# EAGLE design nanobone (EAGLE 6.3)
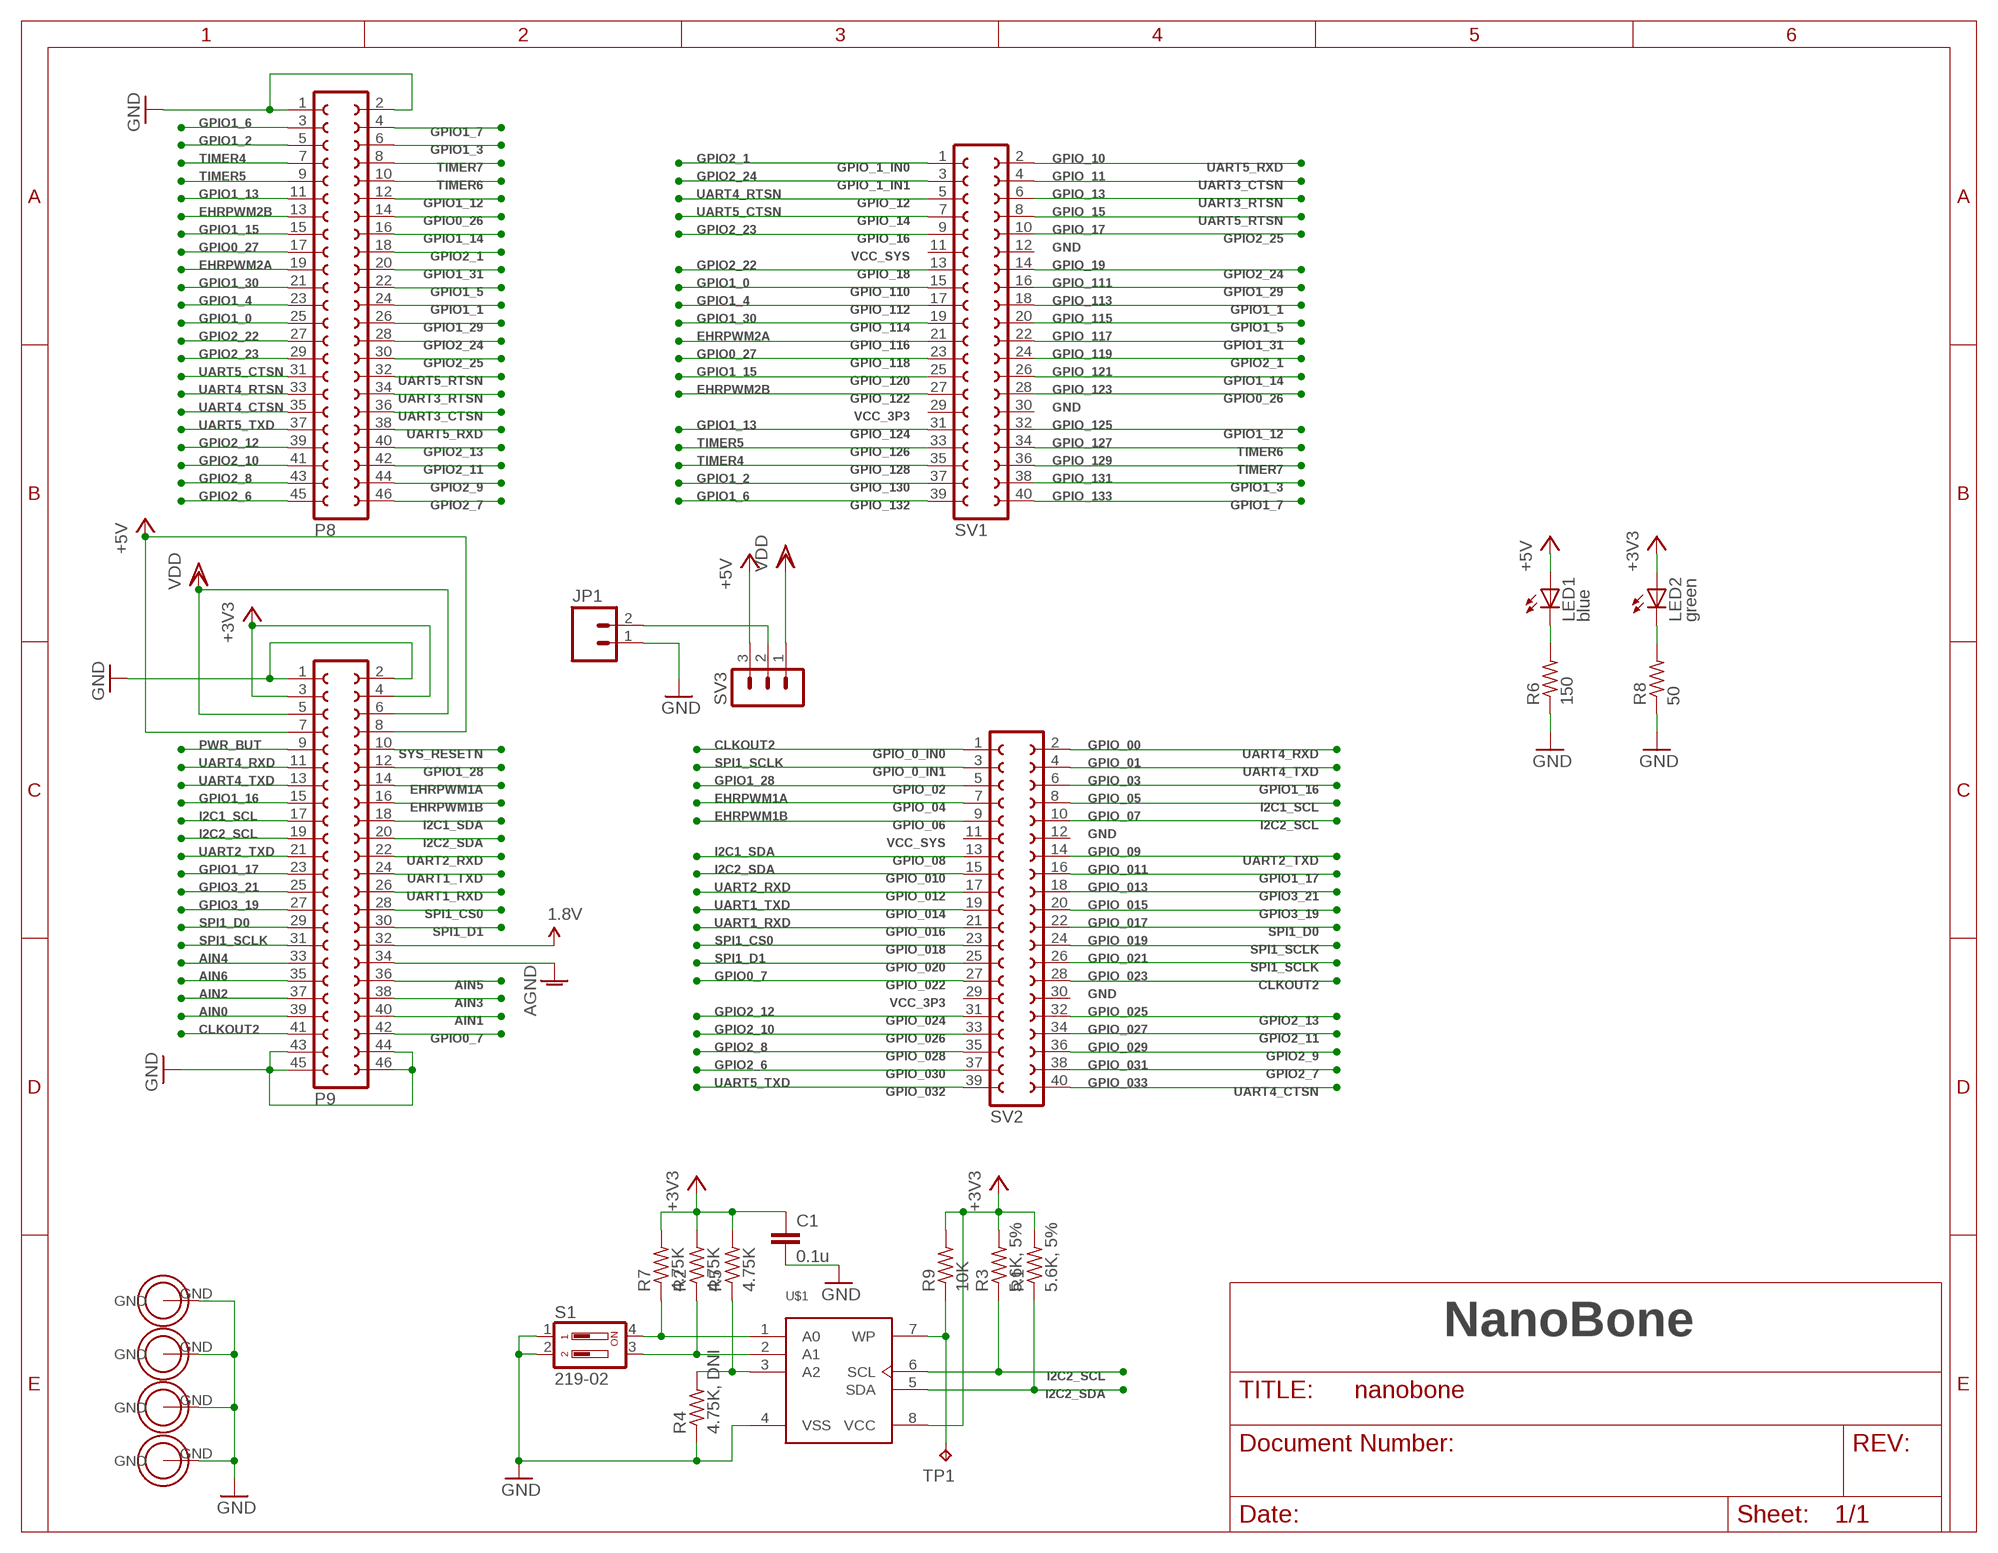
[diagram p0: schematic, sheet 1]

## Parts
C1  0.1u  C-EUC0603  [C0603]
H1  HOLE  [HOLE]
H2  HOLE  [HOLE]
H3  HOLE  [HOLE]
H4  HOLE  [HOLE]
JP1  M02LOCK_LONGPADS  [1X02_LOCK_LONGPADS]
LED1  blue  LEDCHIPLED_0603  [CHIPLED_0603]
LED2  green  LEDCHIPLED_0603  [CHIPLED_0603]
P8  FE23-2_SMD  [FE23-2_SMD]
P9  FE23-2_SMD  [FE23-2_SMD]
R1  5.6K, 5%  R-US_R0603  [R0603]
R2  4.75K  R-US_R0603  [R0603]
R3  5.6K, 5%  R-US_R0603  [R0603]
R4  4.75K, DNI  R-US_R0603  [R0603]
R5  4.75K  R-US_R0603  [R0603]
R6  150  R-US_R0603  [R0603]
R7  4.75K  R-US_R0603  [R0603]
R8  50  R-US_R0603  [R0603]
R9  10K  R-US_R0603  [R0603]
S1  219-02  [CTS-219-02]
SV1  FE20-2  [FE20-2]
SV2  FE20-2  [FE20-2]
SV3  MA03-1  [MA03-1]
TP1  TPB2,54  [B2,54]
U$1  CAT24C256  [SOIC8]

## Nets
1.8V: P9.32
+3V3 [pwr]: C1.1 LED2.A P9.3 P9.4 R1.2 R2.2 R3.2 R5.2 R7.2 R9.2 U$1.8(VCC)
+5V [pwr]: LED1.A P9.7 P9.8 SV3.3
AGND: P9.34
AIN0: P9.39
AIN1: P9.40
AIN2: P9.37
AIN3: P9.38
AIN4: P9.33
AIN5: P9.36
AIN6: P9.35
CLKOUT2: P9.41 SV2.1 SV2.28
EHRPWM1A: P9.14 SV2.7
EHRPWM1B: P9.16 SV2.9
EHRPWM2A: P8.19 SV1.21
EHRPWM2B: P8.13 SV1.27
GND [pwr]: C1.2 H1.GND H2.GND H3.GND H4.GND JP1.1 P8.1 P8.2 P9.1 P9.2 P9.43 P9.44 P9.45 P9.46 R4.1 R6.1 R8.1 S1.1 S1.2 U$1.4(VSS)
GPIO0_7: P9.42 SV2.27
GPIO0_26: P8.14 SV1.28
GPIO0_27: P8.17 SV1.23
GPIO1_0: P8.25 SV1.15
GPIO1_1: P8.24 SV1.18
GPIO1_2: P8.5 SV1.37
GPIO1_3: P8.6 SV1.38
GPIO1_4: P8.23 SV1.17
GPIO1_5: P8.22 SV1.20
GPIO1_6: P8.3 SV1.39
GPIO1_7: P8.4 SV1.40
GPIO1_12: P8.12 SV1.32
GPIO1_13: P8.11 SV1.31
GPIO1_14: P8.16 SV1.26
GPIO1_15: P8.15 SV1.25
GPIO1_16: P9.15 SV2.6
GPIO1_17: P9.23 SV2.16
GPIO1_28: P9.12 SV2.5
GPIO1_29: P8.26 SV1.16
GPIO1_30: P8.21 SV1.19
GPIO1_31: P8.20 SV1.22
GPIO2_1: P8.18 SV1.1 SV1.24
GPIO2_6: P8.45 SV2.37
GPIO2_7: P8.46 SV2.38
GPIO2_8: P8.43 SV2.35
GPIO2_9: P8.44 SV2.36
GPIO2_10: P8.41 SV2.33
GPIO2_11: P8.42 SV2.34
GPIO2_12: P8.39 SV2.31
GPIO2_13: P8.40 SV2.32
GPIO2_22: P8.27 SV1.13
GPIO2_23: P8.29 SV1.9
GPIO2_24: P8.28 SV1.3 SV1.14
GPIO2_25: P8.30 SV1.10
GPIO3_19: P9.27 SV2.20
GPIO3_21: P9.25 SV2.18
I2C1_SCL: P9.17 SV2.8
I2C1_SDA: P9.18 SV2.13
I2C2_SCL: P9.19 R3.1 SV2.10 U$1.6(SCL)
I2C2_SDA: P9.20 R1.1 SV2.15 U$1.5(SDA)
N$1: R7.1 S1.4 U$1.1(A0)
N$2: R2.1 S1.3 U$1.2(A1)
N$3: R4.2 R5.1 U$1.3(A2)
N$4: JP1.2 SV3.2
N$5: R9.1 TP1.TP U$1.7(WP)
N$6: LED1.C R6.2
N$7: LED2.C R8.2
PWR_BUT: P9.9
SPI1_CS0: P9.28 SV2.23
SPI1_D0: P9.29 SV2.22
SPI1_D1: P9.30 SV2.25
SPI1_SCLK: P9.31 SV2.3 SV2.24 SV2.26
SYS_RESETN: P9.10
TIMER4: P8.7 SV1.35
TIMER5: P8.9 SV1.33
TIMER6: P8.10 SV1.34
TIMER7: P8.8 SV1.36
UART1_RXD: P9.26 SV2.21
UART1_TXD: P9.24 SV2.19
UART2_RXD: P9.22 SV2.17
UART2_TXD: P9.21 SV2.14
UART3_CTSN: P8.36 SV1.4
UART3_RTSN: P8.34 SV1.6
UART4_CTSN: P8.35 SV2.40
UART4_RTSN: P8.33 SV1.5
UART4_RXD: P9.11 SV2.2
UART4_TXD: P9.13 SV2.4
UART5_CTSN: P8.31 SV1.7
UART5_RTSN: P8.32 SV1.8
UART5_RXD: P8.38 SV1.2
UART5_TXD: P8.37 SV2.39
VDD [pwr]: P9.5 P9.6 SV3.1
Unconnected: SV1.11 SV1.12 SV1.29 SV1.30 SV2.11 SV2.12 SV2.29 SV2.30

## Notes on the sheet
- GPIO_1_IN0 | GPIO_10
- GPIO_1_IN1 | GPIO_11
- GPIO_12 | GPIO_13
- GPIO_14 | GPIO_15
- GPIO_16 | GPIO_17
- VCC_SYS | GND
- GPIO_18 | GPIO_19
- GPIO_110 | GPIO_111
- GPIO_112 | GPIO_113
- GPIO_114 | GPIO_115
- GPIO_116 | GPIO_117
- GPIO_118 | GPIO_119
- GPIO_120 | GPIO_121
- GPIO_122 | GPIO_123
- VCC_3P3 | GND
- GPIO_124 | GPIO_125
- GPIO_126 | GPIO_127
- GPIO_128 | GPIO_129
- GPIO_130 | GPIO_131
- GPIO_132 | GPIO_133
- GPIO_0_IN0 | GPIO_00
- GPIO_0_IN1 | GPIO_01
- GPIO_02 | GPIO_03
- GPIO_04 | GPIO_05
- GPIO_06 | GPIO_07
- VCC_SYS | GND
- GPIO_08 | GPIO_09
- GPIO_010 | GPIO_011
- GPIO_012 | GPIO_013
- GPIO_014 | GPIO_015
- GPIO_016 | GPIO_017
- GPIO_018 | GPIO_019
- GPIO_020 | GPIO_021
- GPIO_022 | GPIO_023
- VCC_3P3 | GND
- GPIO_024 | GPIO_025
- GPIO_026 | GPIO_027
- GPIO_028 | GPIO_029
- GPIO_030 | GPIO_031
- GPIO_032 | GPIO_033
- NanoBone

## Library data of the parts
C1 = rcl:C-EU: CAPACITOR, European symbol; MPN: VJ0603V104ZXXCW1BC
H1-H4 = BoneCapeParts:HOLE
JP1 = SparkFun-Connectors:M02: Header 2 Standard 2-pin 0.1" header. Use with straight break away headers (SKU : PRT-00116), right angle break away headers (PRT-00553), swiss pins (PRT-00743), machine pins (PRT-00117), and female headers (PRT-00115). Molex polarized connector foot print use with SKU : PRT-08233 with associated crimp pins and housings.
LED1 = led:LED: LED OSRAM: - CHIPLED LG R971, LG N971, LY N971, LG Q971, LY Q971, LO R971, LY R971 LH N974, LH R974 LS Q976, LO Q976, LY Q976 LO Q996 - Hyper CHIPLED LW Q18S LB Q993, LB Q99A, LB R99A - SideLED LS A670, LO A670, LY A670, LG A670, LP A670 LB A673, LV A673, LT A673, LW A673 LH A674 LY A675 LS A676, LA A676, LO A676, LY A676, LW A676 LS A679, LY A679, LG A679 - Hyper Micro SIDELED® LS Y876, LA Y876, LO Y876, LY Y876 LT Y87S - SmartLED LW L88C, LW L88S LB L89C, LB L89S, LG L890 LS L89K, LO L89K, LY L89K LS L896, LA L896, LO L896, LY L896 - TOPLED LS T670, LO T670, LY T670, LG T670, LP T670 LSG T670, LSP T670, LSY T670, LOP T670, LYG T670 LG T671, LOG T671, LSG T671 LB T673, LV T673, LT T673, LW T673 LH T674 LS T676, LA T676, LO T676, LY T676, LB T676, LH T676, LSB T676, LW T676 LB T67C, LV T67C, LT T67C, LS T67K, LO T67K, LY T67K, LW E67C LS E67B, LA E67B, LO E67B, LY E67B, LB E67C, LV E67C, LT E67C LW T67C LS T679, LY T679, LG T679 LS T770, LO T770, LY T770, LG T770, LP T770 LB T773, LV T773, LT T773, LW T773 LH T774 LS E675, LA E675, LY E675, LS T675 LS T776, LA T776, LO T776, LY T776, LB T776 LHGB T686 LT T68C, LB T68C - Hyper Mini TOPLED® LB M676 - Mini TOPLED Santana® LG M470 LS M47K, LO M47K, LY M47K Source: http://www.osram.convergy.de LUXEON: - LUMILED® LXK2-PW12-R00, LXK2-PW12-S00, LXK2-PW14-U00, LXK2-PW14-V00 LXK2-PM12-R00, LXK2-PM12-S00, LXK2-PM14-U00 LXK2-PE12-Q00, LXK2-PE12-R00, LXK2-PE12-S00, LXK2-PE14-T00, LXK2-PE14-U00 LXK2-PB12-K00, LXK2-PB12-L00, LXK2-PB12-M00, LXK2-PB14-N00, LXK2-PB14-P00, LXK2-PB14-Q00 LXK2-PR12-L00, LXK2-PR12-M00, LXK2-PR14-Q00, LXK2-PR14-R00 LXK2-PD12-Q00, LXK2-PD12-R00, LXK2-PD12-S00 LXK2-PH12-R00, LXK2-PH12-S00 LXK2-PL12-P00, LXK2-PL12-Q00, LXK2-PL12-R00 Source: www.luxeon.com KINGBRIGHT: KA-3528ASYC Source: www.kingbright.com; MPN: HT-193NB-5589
LED2 = led:LED: LED OSRAM: - CHIPLED LG R971, LG N971, LY N971, LG Q971, LY Q971, LO R971, LY R971 LH N974, LH R974 LS Q976, LO Q976, LY Q976 LO Q996 - Hyper CHIPLED LW Q18S LB Q993, LB Q99A, LB R99A - SideLED LS A670, LO A670, LY A670, LG A670, LP A670 LB A673, LV A673, LT A673, LW A673 LH A674 LY A675 LS A676, LA A676, LO A676, LY A676, LW A676 LS A679, LY A679, LG A679 - Hyper Micro SIDELED® LS Y876, LA Y876, LO Y876, LY Y876 LT Y87S - SmartLED LW L88C, LW L88S LB L89C, LB L89S, LG L890 LS L89K, LO L89K, LY L89K LS L896, LA L896, LO L896, LY L896 - TOPLED LS T670, LO T670, LY T670, LG T670, LP T670 LSG T670, LSP T670, LSY T670, LOP T670, LYG T670 LG T671, LOG T671, LSG T671 LB T673, LV T673, LT T673, LW T673 LH T674 LS T676, LA T676, LO T676, LY T676, LB T676, LH T676, LSB T676, LW T676 LB T67C, LV T67C, LT T67C, LS T67K, LO T67K, LY T67K, LW E67C LS E67B, LA E67B, LO E67B, LY E67B, LB E67C, LV E67C, LT E67C LW T67C LS T679, LY T679, LG T679 LS T770, LO T770, LY T770, LG T770, LP T770 LB T773, LV T773, LT T773, LW T773 LH T774 LS E675, LA E675, LY E675, LS T675 LS T776, LA T776, LO T776, LY T776, LB T776 LHGB T686 LT T68C, LB T68C - Hyper Mini TOPLED® LB M676 - Mini TOPLED Santana® LG M470 LS M47K, LO M47K, LY M47K Source: http://www.osram.convergy.de LUXEON: - LUMILED® LXK2-PW12-R00, LXK2-PW12-S00, LXK2-PW14-U00, LXK2-PW14-V00 LXK2-PM12-R00, LXK2-PM12-S00, LXK2-PM14-U00 LXK2-PE12-Q00, LXK2-PE12-R00, LXK2-PE12-S00, LXK2-PE14-T00, LXK2-PE14-U00 LXK2-PB12-K00, LXK2-PB12-L00, LXK2-PB12-M00, LXK2-PB14-N00, LXK2-PB14-P00, LXK2-PB14-Q00 LXK2-PR12-L00, LXK2-PR12-M00, LXK2-PR14-Q00, LXK2-PR14-R00 LXK2-PD12-Q00, LXK2-PD12-R00, LXK2-PD12-S00 LXK2-PH12-R00, LXK2-PH12-S00 LXK2-PL12-P00, LXK2-PL12-Q00, LXK2-PL12-R00 Source: www.luxeon.com KINGBRIGHT: KA-3528ASYC Source: www.kingbright.com; MPN: LG Q971-KN-1
P8 P9 = BoneCapeParts:FE23-2_SMD: FEMALE HEADER; MPN: NPPC232KFMS-RC; OC_FARNELL: unknown; OC_NEWARK: unknown
R1 R3 = rcl:R-US_: RESISTOR, American symbol; MPN: RK73B1JTTDD562J
R2 R4 R5 R7 = rcl:R-US_: RESISTOR, American symbol; MPN: CR0603-FX-4751GLF
R6 = rcl:R-US_: RESISTOR, American symbol; MPN: 302-150-RC
R8 = rcl:R-US_: RESISTOR, American symbol; MPN: 302-49.9-RC
R9 = rcl:R-US_: RESISTOR, American symbol; MPN: WR06X1002FTL
S1 = switch-dil:219-02*: Surface Mount DIP Switch Series 219 SMT CTS Electronic Components Sourc: www.ctscorp.com; MPN: 219-2MST; OC_FARNELL: unknown; OC_NEWARK: unknown
SV1 SV2 = BoneCapeParts:FE20-2: FEMALE HEADER; MPN: NPPC202KFMS-RC; OC_FARNELL: unknown; OC_NEWARK: unknown
SV3 = con-lstb:MA03-1: PIN HEADER; OC_FARNELL: unknown; OC_NEWARK: unknown
TP1 = testpad:TP: Test pad
U$1 = BoneCapeParts:CAT24C256; MPN: CAT24C256WI-GT3

## Net classes
0 default: width 0.203 mm, drill 0.381 mm, clearance 0.203 mm
1 pwr: width 0.61 mm, drill 0.508 mm, clearance 0.203 mm

## Board
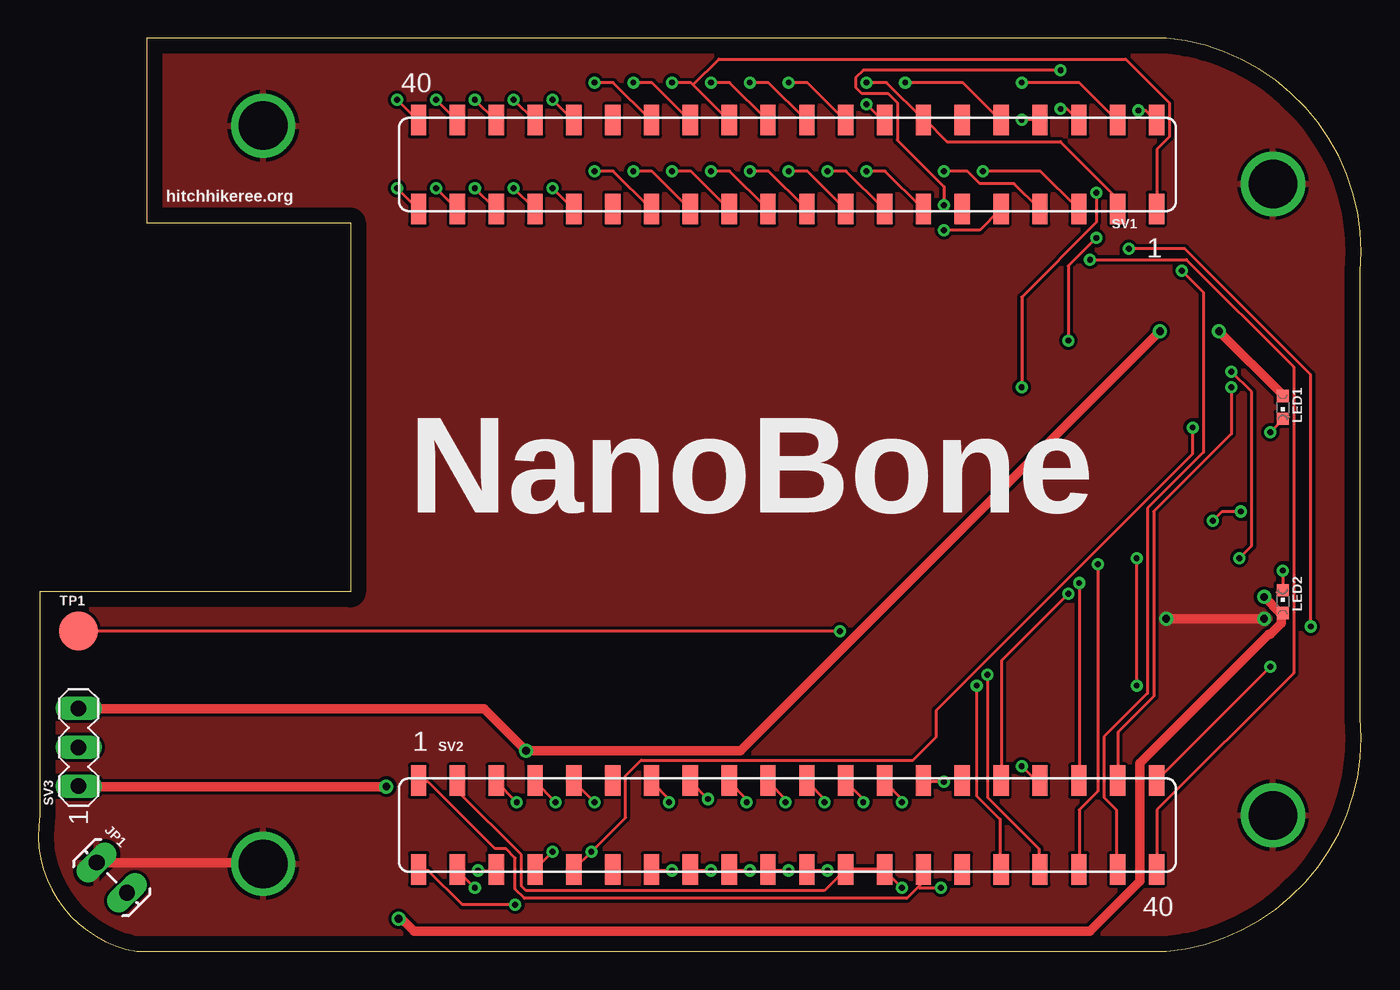
[diagram p1: board, top side]
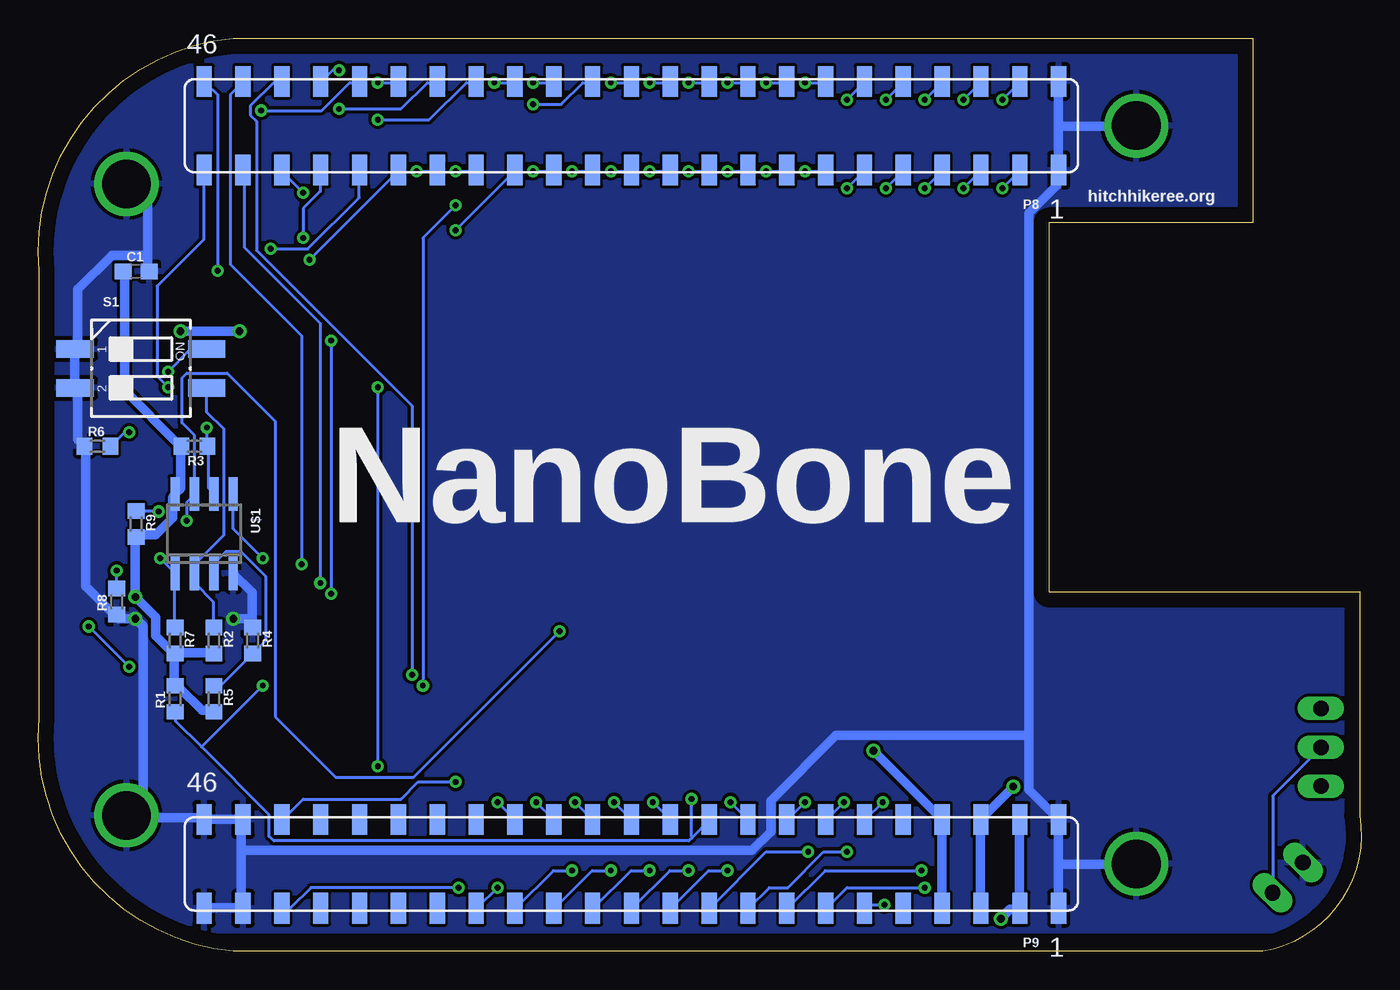
[diagram p2: board, bottom side, seen from below]

Size 86.52 x 59.69 mm. Coordinates in mm from the lower left corner, seen from the top.
Outline: 0.1,23.49 0.1,8.89 arc90 6.45,0 73.76,0 arc90 86.46,15.24 86.46,44.45 arc90 73.76,59.69 7.09,59.69 7.09,47.62 20.42,47.62 20.42,23.49 0.1,23.49
Copper layers (1*16): Top 0.035mm / dielectric 1.5mm / Bottom 0.035mm
Design rules "default *": minimum track width 6mil, minimum drill 15mil, track to track 8mil, track to pad 8mil, pad to pad 8mil, via to via 8mil, smd to smd 8mil, copper to edge 40mil, drill to drill 8mil, minimum pad ring 10mil, minimum via ring 8mil, stop-mask expansion 4mil, vias tented up to drill 20mil, thermal gap 10mil

### Footprints (pad centres in the part's own frame; a part is rotated, then mirrored left to right if it is on the bottom)
C0603 = smd 1.1 x 1: 1 -0.85,0; 2 0.85,0
HOLE = drill 3.175: GND 0,0
1X02_LOCK_LONGPADS = drill 1.016 long: 1 -0.127,0; 2 2.667,0
CHIPLED_0603 = smd 0.8 x 0.8: A 0,-0.75; C 0,0.75
FE23-2_SMD = smd 1 x 2: 1 -24.13,2.9; 2 -24.13,-2.9; 3 -21.59,2.9; 4 -21.59,-2.9; 5 -19.05,2.9; 6 -19.05,-2.9; 7 -16.51,2.9; 8 -16.51,-2.9; 9 -13.97,2.9; 10 -13.97,-2.9; 11 -11.43,2.9; 12 -11.43,-2.9; 13 -8.89,2.9; 14 -8.89,-2.9; 15 -6.35,2.9; 16 -6.35,-2.9; 17 -3.81,2.9; 18 -3.81,-2.9; 19 -1.27,2.9; 20 -1.27,-2.9; 21 1.27,2.9; 22 1.27,-2.9; 23 3.81,2.9; 24 3.81,-2.9; 25 6.35,2.9; 26 6.35,-2.9; 27 8.89,2.9; 28 8.89,-2.9; 29 11.43,2.9; 30 11.43,-2.9; 31 13.97,2.9; 32 13.97,-2.9; 33 16.51,2.9; 34 16.51,-2.9; 35 19.05,2.9; 36 19.05,-2.9; 37 21.59,2.9; 38 21.59,-2.9; 39 24.13,2.9; 40 24.13,-2.9; 41 26.67,2.9; 42 26.67,-2.9; 43 29.21,2.9; 44 29.21,-2.9; 45 31.75,2.9; 46 31.75,-2.9
R0603 = smd 1 x 1.1: 1 -0.85,0; 2 0.85,0
CTS-219-02 = smd 1.13 x 2.44: 1 -1.27,-4.3; 2 1.27,-4.3; 3 1.27,4.3; 4 -1.27,4.3
FE20-2 = smd 1 x 2: 1 -24.13,2.9; 2 -24.13,-2.9; 3 -21.59,2.9; 4 -21.59,-2.9; 5 -19.05,2.9; 6 -19.05,-2.9; 7 -16.51,2.9; 8 -16.51,-2.9; 9 -13.97,2.9; 10 -13.97,-2.9; 11 -11.43,2.9; 12 -11.43,-2.9; 13 -8.89,2.9; 14 -8.89,-2.9; 15 -6.35,2.9; 16 -6.35,-2.9; 17 -3.81,2.9; 18 -3.81,-2.9; 19 -1.27,2.9; 20 -1.27,-2.9; 21 1.27,2.9; 22 1.27,-2.9; 23 3.81,2.9; 24 3.81,-2.9; 25 6.35,2.9; 26 6.35,-2.9; 27 8.89,2.9; 28 8.89,-2.9; 29 11.43,2.9; 30 11.43,-2.9; 31 13.97,2.9; 32 13.97,-2.9; 33 16.51,2.9; 34 16.51,-2.9; 35 19.05,2.9; 36 19.05,-2.9; 37 21.59,2.9; 38 21.59,-2.9; 39 24.13,2.9; 40 24.13,-2.9
MA03-1 = drill 1.016 long: 1 -2.54,0; 2 0,0; 3 2.54,0
B2,54 = smd 2.54 x 2.54: TP 0,0
SOIC8 = smd 0.6 x 2.2: 1 -1.905,-2.6; 2 -0.635,-2.6; 3 0.635,-2.6; 4 1.905,-2.6; 5 1.905,2.6; 6 0.635,2.6; 7 -0.635,2.6; 8 -1.905,2.6

### Placement (x,y rotation side)
C1  80.11,44.45 0 bottom
H1  14.71,5.72 0 top
H2  80.75,8.89 0 top
H3  14.71,53.97 0 top
H4  80.75,50.16 0 top
JP1  3.91,5.72 315 top
LED1  [CHIPLED_0603]  81.38,35.56 180 top
LED2  [CHIPLED_0603]  81.38,22.86 0 top
P8  43.92,53.97 180 bottom
P9  43.92,5.72 180 bottom
R1  77.57,16.51 90 bottom
R2  75.03,20.32 270 bottom
R3  76.3,33.02 180 bottom
R4  72.49,20.32 270 bottom
R5  75.03,16.51 270 bottom
R6  4.75K  [R0603]  82.65,33.02 0 bottom
R7  77.57,20.32 270 bottom
R8  4.75K  [R0603]  81.38,22.86 90 bottom
R9  80.11,27.94 270 bottom
S1  79.81,38.1 270 bottom
SV1  49,51.43 180 top
SV2  49,8.25 0 top
SV3  2.64,13.33 90 top
TP1  2.64,20.96 0 top
U$1  75.67,27.3 0 bottom

### Tracks (layer width: path | path; a pad name or v marks a point on that pad's centre or on a via)
+3V3  (via drill 0.51)
  Top 0.61: v80.16,23.16 81.18,22.15 81.38,22.15 LED2.A 81.28,21.84 81.28,21.44 80.57,20.73 80.47,20.73 72.04,12.29 72.04,4.57 68.79,1.32 24.59,1.32 23.78,2.13 v23.57,2.13
  Bottom 0.61: P9.4 22.35,8.53 22.35,2.84 P9.3 22.66,2.74 22.96,2.74 v23.57,2.13 | R2.2 75.08,19.51 77.52,19.51 R7.2 | R5.2 75.08,15.75 75.8,15.75 77.32,17.27 77.52,17.27 R1.2 77.62,17.68 77.62,19.2 R7.2 | C1.1 80.88,44.4 80.88,36.68 77.42,33.22 R3.2 77.22,33.02 77.22,30.28 77.52,29.97 U$1.8 77.73,29.67 77.73,28.35 78.84,27.23 79.86,27.23 R9.2 80.16,27.03 v80.16,23.16 78.84,21.84 78.84,20.62 77.83,19.61 R7.2
+5V  (via drill 0.51)
  Top 0.61: v77.22,40.54 81.38,36.37 LED1.A | v73.36,40.54 45.93,13.11 v31.9,13.11 29.16,15.85 2.64,15.85 SV3.3
  Bottom 0.61: v73.36,40.54 v77.22,40.54 | v31.9,13.11 27.43,8.64 P9.8 27.43,8.33 27.43,2.84 P9.7
CLKOUT2  (via drill 0.38)
  Top 0.203: 57.56,4.22 57.81,4.47 57.81,5.28 SV2.28 | 57.56,4.22 56.8,3.45 31.8,3.45 31.19,4.06 31.19,6.1 30.58,6.71 29.87,6.71 25.5,11.07 24.89,11.07 SV2.1 | v59.03,4.17 57.61,4.17 57.56,4.22
  Bottom 0.203: v59.03,4.17 68.68,4.17 70,2.84 70.51,2.84 P9.41
EHRPWM1A  (via drill 0.38)
  Top 0.203: v33.83,9.75 32.51,11.07 SV2.7
  Bottom 0.203: v33.83,9.75 34.95,8.64 P9.14
EHRPWM1B  (via drill 0.38)
  Top 0.203: v36.37,9.75 35.05,11.07 SV2.9
  Bottom 0.203: v36.37,9.75 37.49,8.64 P9.16
EHRPWM2A  (via drill 0.38)
  Top 0.203: v43.99,51 45.21,51 47.65,48.56 SV1.21
  Bottom 0.203: v43.99,51 42.67,51 P8.19
EHRPWM2B  (via drill 0.38)
  Top 0.203: v36.37,51 37.59,51 40.03,48.56 SV1.27
  Bottom 0.203: v36.37,51 35.05,51 P8.13
GND  (via drill 0.51)
  Top 0.61: v80.16,21.74 v73.76,21.74 | JP1.1 3.86,5.79 14.63,5.79 H1.GND
  Bottom 0.61: P9.45 75.59,2.84 73.15,2.84 P9.43 73.26,3.15 73.26,6.6 | 73.26,6.6 73.26,8.33 P9.44 73.15,8.64 75.59,8.64 P9.46 75.9,8.74 80.57,8.74 80.67,8.84 H2.GND 79.66,8.94 79.66,21.23 v80.16,21.74 81.28,21.74 R8.1 81.38,22.05 81.59,22.05 83.42,23.88 83.42,33.02 R6.1 83.72,33.22 83.92,33.43 83.92,36.58 S1.2 84.13,36.88 84.13,39.32 S1.1 83.92,39.62 83.92,43.28 81.69,45.52 79.35,45.52 | 79.35,45.52 79.35,48.77 H4.GND | 79.35,45.52 79.35,44.5 C1.2 | 72.54,21.74 72.54,23.47 73.76,24.69 U$1.4 | 72.54,21.74 72.54,21.23 R4.1 | v73.76,21.74 72.54,21.74 | 19.81,53.95 19.81,56.79 P8.2 | 19.81,53.95 19.81,51.1 P8.1 19.92,50.8 19.92,50.09 21.74,48.26 21.74,14.12 | 19.81,53.95 14.73,53.95 H3.GND | 19.81,5.69 19.81,8.53 P9.2 20.02,8.84 21.74,10.57 21.74,14.12 | 19.81,5.69 19.81,2.84 P9.1 | 19.81,5.69 14.73,5.69 H1.GND | 73.26,6.6 39.83,6.6 38.61,7.82 38.61,9.86 34.34,14.12 21.74,14.12
  pour Top: 0.61,62.08 85.75,62.08 85.75,0.51 0.41,0.51 1.32,61.06
  pour Bottom: 1.37,60.43 85.83,60.43 85.83,1.37 0.74,1.37 0.74,59.79
GPIO0_7  (via drill 0.38)
  Top 0.203: v59.23,11.07 57.91,11.07 SV2.27
  Bottom 0.203: v59.23,11.07 61.67,11.07 62.79,9.96 69.19,9.96 70.51,8.64 P9.42
GPIO0_26  (via drill 0.38)
  Top 0.203: v36.37,56.79 37.59,56.79 40.03,54.36 SV1.28
  Bottom 0.203: v36.37,56.79 35.05,56.79 P8.14
GPIO0_27  (via drill 0.38)
  Top 0.203: v41.45,51 42.67,51 45.11,48.56 SV1.23
  Bottom 0.203: v41.45,51 40.13,51 P8.17
GPIO1_0  (via drill 0.38)
  Top 0.203: v51.61,51 52.83,51 55.27,48.56 SV1.15
  Bottom 0.203: v51.61,51 50.29,51 P8.25
GPIO1_1  (via drill 0.38)
  Top 0.203: v49.07,56.79 50.29,56.79 52.73,54.36 SV1.18
  Bottom 0.203: v49.07,56.79 47.75,56.79 P8.24
GPIO1_2  (via drill 0.38)
  Top 0.203: v26.01,49.89 27.33,48.56 SV1.37
  Bottom 0.203: v26.01,49.89 24.89,51 P8.5
GPIO1_3  (via drill 0.38)
  Top 0.203: v26.01,55.68 27.33,54.36 SV1.38
  Bottom 0.203: v26.01,55.68 24.89,56.79 P8.6
GPIO1_4  (via drill 0.38)
  Top 0.203: v49.07,51 50.29,51 52.73,48.56 SV1.17
  Bottom 0.203: v49.07,51 47.75,51 P8.23
GPIO1_5  (via drill 0.38)
  Top 0.203: v46.53,56.79 47.75,56.79 50.19,54.36 SV1.20
  Bottom 0.203: v46.53,56.79 45.21,56.79 P8.22
GPIO1_6  (via drill 0.38)
  Top 0.203: v23.47,49.89 24.79,48.56 SV1.39
  Bottom 0.203: v23.47,49.89 22.35,51 P8.3
GPIO1_7  (via drill 0.38)
  Top 0.203: v23.47,55.68 24.79,54.36 SV1.40
  Bottom 0.203: v23.47,55.68 22.35,56.79 P8.4
GPIO1_12  (via drill 0.38)
  Top 0.203: v33.63,55.68 34.95,54.36 SV1.32
  Bottom 0.203: v33.63,55.68 32.51,56.79 P8.12
GPIO1_13  (via drill 0.38)
  Top 0.203: v33.63,49.89 34.95,48.56 SV1.31
  Bottom 0.203: v33.63,49.89 32.51,51 P8.11
GPIO1_14  (via drill 0.38)
  Top 0.203: v38.91,56.79 40.13,56.79 42.57,54.36 SV1.26
  Bottom 0.203: v38.91,56.79 37.59,56.79 P8.16
GPIO1_15  (via drill 0.38)
  Top 0.203: v38.91,51 40.13,51 42.57,48.56 SV1.25
  Bottom 0.203: v38.91,51 37.59,51 P8.15
GPIO1_16  (via drill 0.38)
  Top 0.203: v28.75,5.28 29.87,5.28 SV2.6
  Bottom 0.203: v28.75,5.28 35.05,5.28 37.49,2.84 P9.15
GPIO1_17  (via drill 0.38)
  Top 0.203: v43.99,5.28 42.67,5.28 SV2.16
  Bottom 0.203: v43.99,5.28 45.21,5.28 47.65,2.84 P9.23
GPIO1_28  (via drill 0.38)
  Top 0.203: v31.29,9.75 29.97,11.07 SV2.5
  Bottom 0.203: v31.29,9.75 32.41,8.64 P9.12
GPIO1_29  (via drill 0.38)
  Top 0.203: v54.15,55.37 55.27,54.25 SV1.16
  Bottom 0.203: v54.15,55.37 52.33,55.37 50.9,56.79 50.29,56.79 P8.26
GPIO1_30  (via drill 0.38)
  Top 0.203: v46.53,51 47.75,51 50.19,48.56 SV1.19
  Bottom 0.203: v46.53,51 45.21,51 P8.21
GPIO1_31  (via drill 0.38)
  Top 0.203: v43.99,56.79 45.21,56.79 47.65,54.36 SV1.22
  Bottom 0.203: v43.99,56.79 42.67,56.79 P8.20
GPIO2_1  (via drill 0.38)
  Top 0.203: v41.45,56.79 42.67,56.79 42.83,56.64 | 42.83,56.64 45.11,54.36 SV1.24 | 42.83,56.64 44.5,58.32 71.12,58.32 73.97,55.47 73.97,53.24 73.15,52.43 73.15,48.56 SV1.1
  Bottom 0.203: v41.45,56.79 40.13,56.79 P8.18
GPIO2_6  (via drill 0.38)
  Top 0.203: v78.03,36.88 78.03,33.83 72.95,28.75 72.95,16.66 70.61,14.33 70.61,11.18 SV2.37
  Bottom 0.203: v78.03,36.88 78.74,37.59 78.74,43.48 75.69,46.53 75.69,51 P8.45
GPIO2_7  (via drill 0.38)
  Top 0.203: v74.78,44.5 76.2,43.08 76.2,32.61 72.54,28.96 72.54,16.87 69.7,14.02 69.7,10.06 70.51,9.25 70.51,5.38 SV2.38
  Bottom 0.203: v74.78,44.5 74.78,55.98 75.59,56.79 P8.46
GPIO2_8  (via drill 0.38)
  Top 0.203: v68.07,24.08 68.07,11.18 SV2.35
  Bottom 0.203: v68.07,24.08 68.07,41.05 73.05,46.02 73.05,51 P8.43
GPIO2_9  (via drill 0.38)
  Top 0.203: v69.29,25.3 69.29,10.46 68.07,9.25 68.07,5.38 SV2.36
  Bottom 0.203: v69.29,25.3 69.29,40.23 73.97,44.91 73.97,55.98 73.15,56.79 P8.44
GPIO2_10  (via drill 0.38)
  Top 0.203: v64.31,12.09 65.23,11.18 65.43,11.18 SV2.33 | v64.31,36.88 64.31,42.77 69.19,47.65 v69.19,49.58
  Bottom 0.203: v64.31,36.88 v64.31,12.09 | v69.19,49.58 70.61,51 P8.41
GPIO2_11  (via drill 0.38)
  Top 0.203: v62.08,18.08 62.08,10.06 65.43,6.71 65.43,5.38 SV2.34
  Bottom 0.203: v62.08,18.08 62.08,35.66 72.24,45.82 72.24,54.25 72.65,54.66 72.65,55.27 71.12,56.79 70.61,56.79 P8.42
GPIO2_12  (via drill 0.38)
  Top 0.203: v67.36,23.37 62.99,19 62.99,11.18 SV2.31 | v67.36,39.93 67.36,44.81 v69.19,46.63
  Bottom 0.203: v67.36,39.93 v67.36,23.37 | v69.19,46.63 69.19,48.56 68.07,49.68 68.07,51 P8.39
GPIO2_13  (via drill 0.38)
  Top 0.203: v61.37,17.37 61.37,10.16 62.89,8.64 62.89,5.38 SV2.32 | v59.23,48.77 59.23,49.99 56.19,53.04 56.19,55.47 55.58,56.08 53.85,56.08 53.44,56.49 53.44,57.1 53.95,57.61 v66.85,57.61
  Bottom 0.203: v61.37,17.37 61.37,46.63 v59.23,48.77 | v66.85,57.61 67.26,57.61 67.97,56.9 P8.40
GPIO2_22  (via drill 0.38)
  Top 0.203: v54.15,51 55.37,51 57.81,48.56 SV1.13
  Bottom 0.203: v54.15,51 52.83,51 P8.27
GPIO2_23  (via drill 0.38)
  Top 0.203: v59.23,47.14 61.57,47.14 62.89,48.46 SV1.9
  Bottom 0.203: v59.23,47.14 55.37,51 P8.29
GPIO2_24  (via drill 0.38)
  Top 0.203: v54.15,56.79 55.48,56.79 57.91,54.36 SV1.14 58.02,54.36 59.44,52.93 66.85,52.93 70.51,49.28 70.51,48.56 SV1.3
  Bottom 0.203: v54.15,56.79 52.83,56.79 P8.28
GPIO2_25  (via drill 0.38)
  Top 0.203: v56.69,56.79 60.45,56.79 62.89,54.36 SV1.10
  Bottom 0.203: v56.69,56.79 55.37,56.79 P8.30
GPIO3_19  (via drill 0.38)
  Top 0.203: v49.07,5.28 47.75,5.28 SV2.20
  Bottom 0.203: v49.07,5.28 50.29,5.28 52.73,2.84 P9.27
GPIO3_21  (via drill 0.38)
  Top 0.203: v46.53,5.28 45.21,5.28 SV2.18
  Bottom 0.203: v46.53,5.28 47.75,5.28 50.19,2.84 P9.25
I2C1_SCL  (via drill 0.38)
  Top 0.203: v33.63,6.5 32.51,5.38 SV2.8
  Bottom 0.203: v33.63,6.5 35.16,6.5 37.49,4.17 38.71,4.17 40.03,2.84 P9.17
I2C1_SDA  (via drill 0.38)
  Top 0.203: v41.25,9.75 41.25,9.96 40.13,11.07 SV2.13
  Bottom 0.203: v41.25,9.75 40.13,8.64 P9.18
I2C2_SCL  (via drill 0.38)
  Top 0.203: SV2.10 35.05,5.38 v36.17,6.5 38.41,8.74 38.41,11.48 39.42,12.5 57.2,12.5 58.73,14.02 58.73,15.75 75.49,32.51 v75.49,34.24
  Bottom 0.203: U$1.6 75.08,29.97 75.39,30.28 75.39,33.02 R3.1 75.49,33.02 v75.49,34.24 | v36.17,6.5 38.91,6.5 42.57,2.84 P9.19
I2C2_SDA  (via drill 0.38)
  Top 0.203: v43.79,9.96 42.67,11.07 SV2.15 | v71.83,17.37 v71.83,25.7
  Bottom 0.203: 75.85,13.36 71.43,8.94 71.43,7.52 71.12,7.21 43.99,7.21 43.74,7.47 | 75.85,13.36 77.52,15.04 77.52,15.65 R1.1 | 43.74,7.47 42.67,8.53 P9.20 | v43.79,9.96 43.79,7.52 43.74,7.47 | U$1.5 73.76,27.64 v71.83,25.7 | 75.85,13.36 v71.83,17.37
N$1  (via drill 0.38)
  Top 0.203: v78.03,37.9 79.35,36.58 79.35,26.52 v78.54,25.7
  Bottom 0.203: R7.1 77.62,21.23 77.62,24.69 U$1.1 77.62,24.79 v78.54,25.7 | v78.03,37.9 76.61,39.32 75.59,39.32 S1.4
N$2
  Bottom 0.203: R2.1 75.08,21.23 75.08,22.86 76.3,24.08 U$1.2 76.3,25.3 74.37,27.23 74.37,34.14 75.49,35.26 75.49,36.78 S1.3
N$3
  Bottom 0.203: R5.1 74.98,17.37 74.58,17.37 72.54,19.41 R4.2 72.44,19.51 71.63,20.32 71.63,24.49 73.26,26.11 74.27,26.11 74.98,25.4 74.98,24.79 U$1.3
N$4
  Bottom 0.203: JP1.2 5.79,3.86 5.79,10.16 2.64,13.31 SV3.2
N$5  (via drill 0.38)
  Top 0.203: v78.64,28.75 77.42,28.75 v76.81,28.14 | v52.43,20.93 2.64,20.93 TP1.TP
  Bottom 0.203: v78.64,28.75 80.06,28.75 R9.1 | v76.81,28.14 76.81,29.36 76.3,29.87 U$1.7 76.3,33.73 77.12,34.54 77.12,37.49 76.81,37.8 74.17,37.8 71.02,34.65 71.02,15.34 67.06,11.38 61.98,11.38 v52.43,20.93
N$6  (via drill 0.38)
  Top 0.203: v80.57,33.93 81.38,34.75 LED1.C
  Bottom 0.203: v80.57,33.93 80.88,33.93 81.79,33.02 R6.2
N$7  (via drill 0.38)
  Top 0.203: v81.38,24.89 LED2.C
  Bottom 0.203: R8.2 v81.38,24.89
SPI1_CS0  (via drill 0.38)
  Top 0.203: v53.95,9.75 53.95,9.96 52.83,11.07 SV2.23
  Bottom 0.203: v53.95,9.75 52.83,8.64 P9.28
SPI1_D0  (via drill 0.38)
  Top 0.203: v51.61,5.28 50.29,5.28 SV2.22
  Bottom 0.203: v51.61,5.28 52.83,5.28 55.27,2.84 P9.29
SPI1_D1  (via drill 0.38)
  Top 0.203: v56.49,9.75 56.49,9.96 55.37,11.07 SV2.25
  Bottom 0.203: v56.49,9.75 55.37,8.64 P9.30
SPI1_SCLK  (via drill 0.38)
  Top 0.203: SV2.3 27.43,11.07 27.43,10.46 31.6,6.3 31.6,4.27 31.9,3.96 51.41,3.96 52.73,5.28 SV2.24 52.83,5.38 55.27,5.38 SV2.26 55.37,5.28 v56.49,4.17
  Bottom 0.203: v56.49,4.17 57.81,2.84 P9.31
TIMER4  (via drill 0.38)
  Top 0.203: v28.55,49.89 29.87,48.56 SV1.35
  Bottom 0.203: v28.55,49.89 27.43,51 P8.7
TIMER5  (via drill 0.38)
  Top 0.203: v31.09,49.89 32.41,48.56 SV1.33
  Bottom 0.203: v31.09,49.89 29.97,51 P8.9
TIMER6  (via drill 0.38)
  Top 0.203: v31.09,55.68 32.41,54.36 SV1.34
  Bottom 0.203: v31.09,55.68 29.97,56.79 P8.10
TIMER7  (via drill 0.38)
  Top 0.203: v28.55,55.68 29.87,54.36 SV1.36
  Bottom 0.203: v28.55,55.68 27.43,56.79 P8.8
UART1_RXD  (via drill 0.38)
  Top 0.203: v51.41,9.75 51.41,9.96 50.29,11.07 SV2.21
  Bottom 0.203: v51.41,9.75 50.29,8.64 P9.26
UART1_TXD  (via drill 0.38)
  Top 0.203: v48.87,9.75 48.87,9.96 47.75,11.07 SV2.19
  Bottom 0.203: v48.87,9.75 47.75,8.64 P9.24
UART2_RXD  (via drill 0.38)
  Top 0.203: v46.33,9.75 46.33,9.96 45.21,11.07 SV2.17
  Bottom 0.203: v46.33,9.75 45.21,8.64 P9.22
UART2_TXD  (via drill 0.38)
  Top 0.203: v41.45,5.28 40.13,5.28 SV2.14
  Bottom 0.203: v41.45,5.28 42.67,5.28 45.11,2.84 P9.21
UART3_CTSN  (via drill 0.38)
  Top 0.203: v64.31,56.79 68.07,56.79 70.51,54.36 SV1.4
  Bottom 0.203: v64.31,56.79 62.99,56.79 P8.36
UART3_RTSN  (via drill 0.38)
  Top 0.203: v66.85,55.07 67.26,55.07 67.97,54.36 SV1.6
  Bottom 0.203: v66.85,55.07 62.79,55.07 61.06,56.79 60.45,56.79 P8.34
UART4_CTSN  (via drill 0.38)
  Top 0.203: v68.79,45.21 75.08,45.21 82.09,38.2 82.09,18.19 73.15,9.25 73.15,5.38 SV2.40
  Bottom 0.203: v68.79,45.21 62.99,51 P8.35
UART4_RTSN  (via drill 0.38)
  Top 0.203: v61.77,51 65.53,51 67.97,48.56 SV1.5
  Bottom 0.203: v61.77,51 60.45,51 P8.33
UART4_RXD  (via drill 0.38)
  Top 0.203: v31.19,3.05 27.74,3.05 25.5,5.28 24.89,5.28 SV2.2
  Bottom 0.203: v31.19,3.05 32.21,3.05 32.41,2.84 P9.11
UART4_TXD  (via drill 0.38)
  Top 0.203: v28.55,4.17 27.43,5.28 SV2.4
  Bottom 0.203: v28.55,4.17 33.63,4.17 34.95,2.84 P9.13
UART5_CTSN  (via drill 0.38)
  Top 0.203: v59.23,51 60.76,51 61.57,50.19 63.81,50.19 65.43,48.56 SV1.7
  Bottom 0.203: v59.23,51 57.91,51 P8.31
UART5_RTSN  (via drill 0.38)
  Top 0.203: v64.31,54.36 65.43,54.36 SV1.8
  Bottom 0.203: v64.31,54.36 60.96,54.36 58.52,56.79 57.91,56.79 P8.32
UART5_RXD  (via drill 0.38)
  Top 0.203: v71.93,54.97 72.44,54.97 73.05,54.36 SV1.2
  Bottom 0.203: v71.93,54.97 67.97,54.97 66.14,56.79 65.53,56.79 P8.38
UART5_TXD  (via drill 0.38)
  Top 0.203: v71.33,45.92 74.98,45.92 83.21,37.69 v83.21,21.23 | v80.57,18.59 73.15,11.18 SV2.39
  Bottom 0.203: v71.33,45.92 68.89,45.92 65.53,49.28 65.53,51 P8.37 | v80.57,18.59 v83.21,21.23
VDD  (via drill 0.51)
  Top 0.61: v22.76,10.77 2.64,10.77 SV3.1
  Bottom 0.61: P9.5 24.89,2.84 24.89,8.53 P9.6 24.69,8.84 v22.76,10.77

### Text on the board
tPlace: hitchhikeree.org | NanoBone
bPlace: hitchhikeree.org | NanoBone